# EAGLE design CompleteBoard (EAGLE 9.4.2)
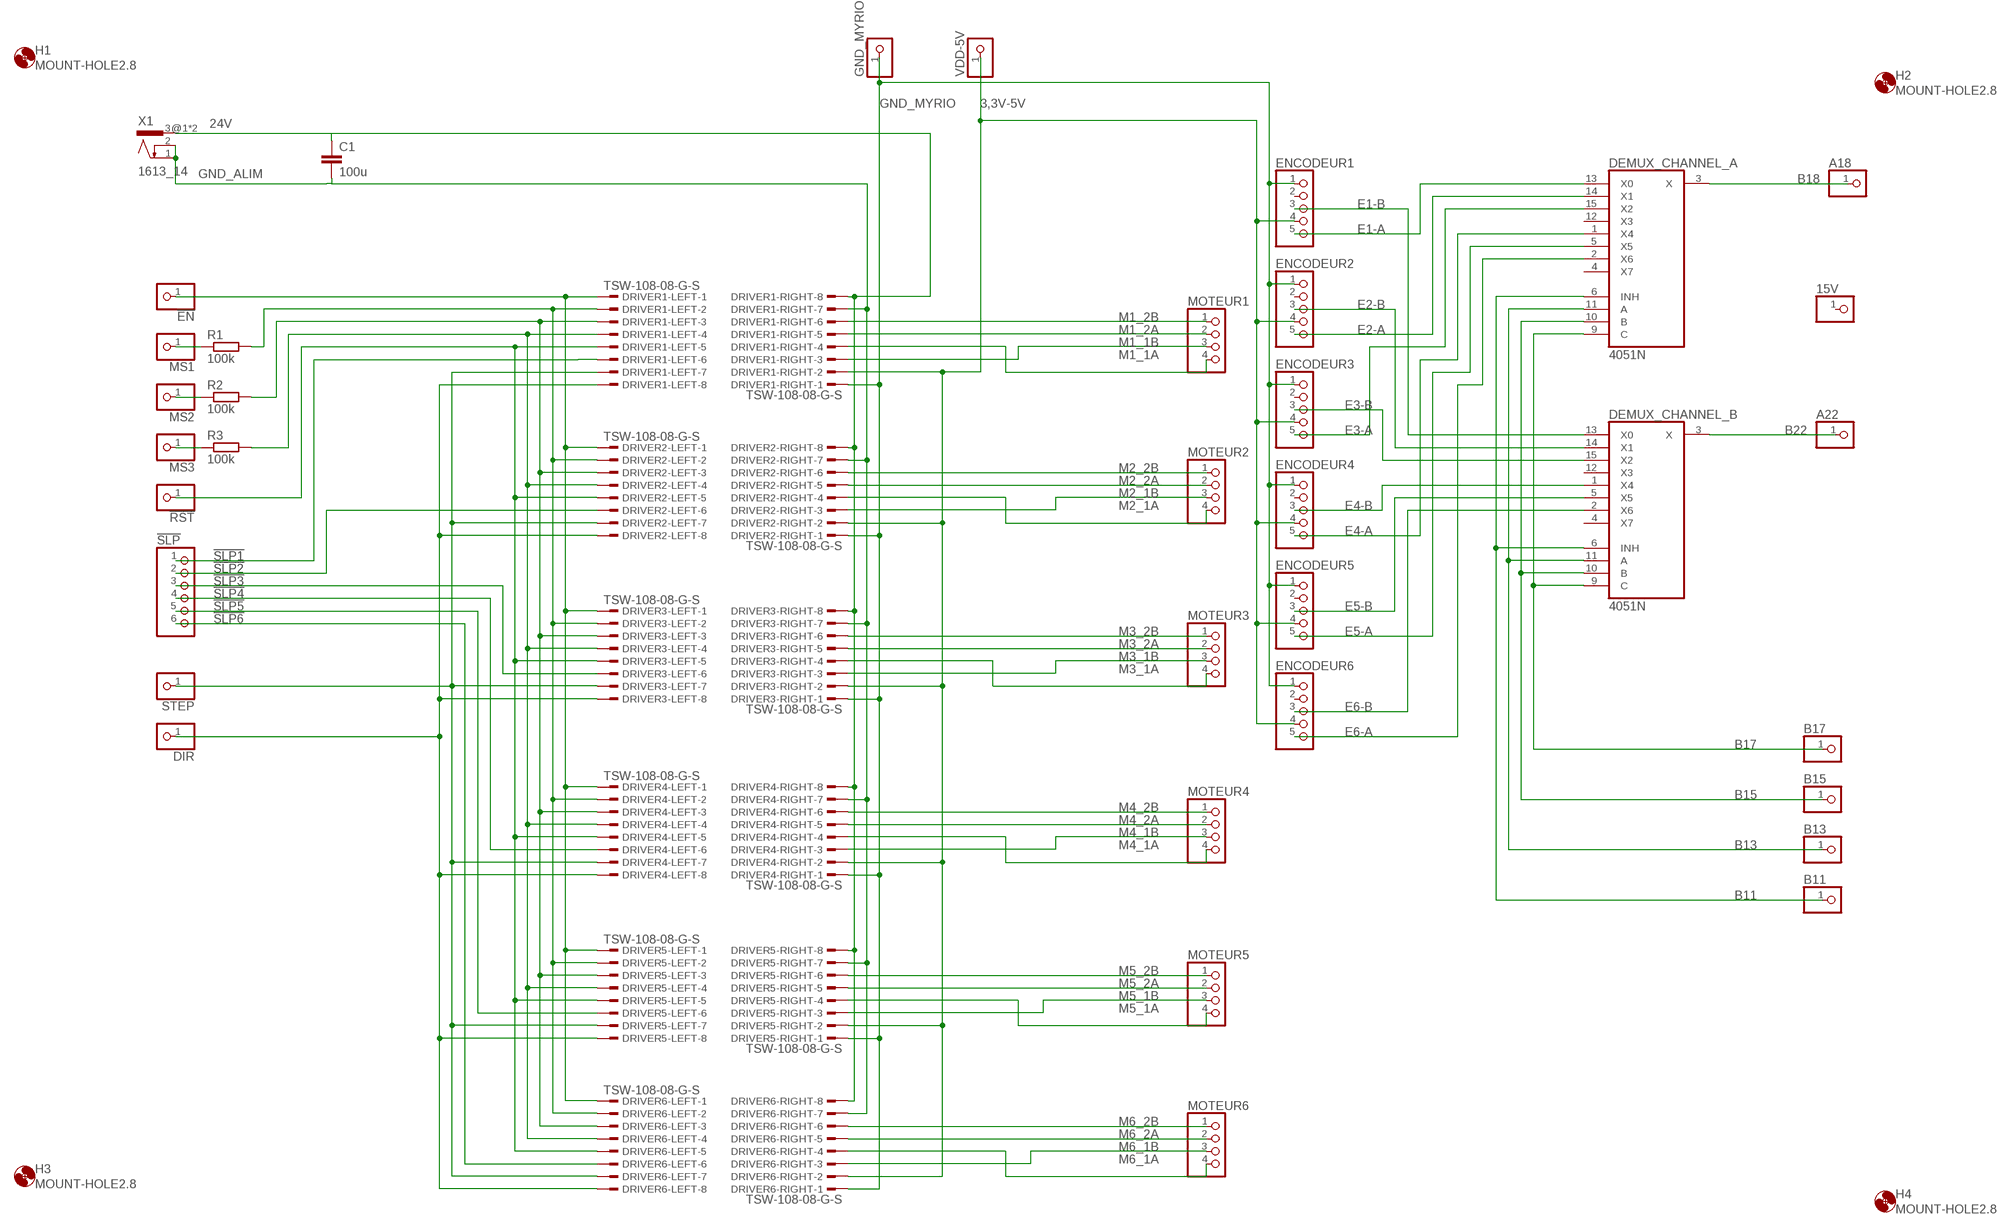
[diagram p0: schematic, sheet 1]

## Parts
15V  PINHD-1X1  [1X01]
!EN  PINHD-1X1  [1X01]
!RST  PINHD-1X1  [1X01]
!SLP  PINHD-1X6  [1X06]
A18  PINHD-1X1  [1X01]
A22  PINHD-1X1  [1X01]
B11  PINHD-1X1  [1X01]
B13  PINHD-1X1  [1X01]
B15  PINHD-1X1  [1X01]
B17  PINHD-1X1  [1X01]
C1  100u  C-EU025-025X050  [C025-025X050]
DEMUX_CHANNEL_A  4051N  [DIL16]
DEMUX_CHANNEL_B  4051N  [DIL16]
DIR  PINHD-1X1  [1X01]
DRIVER1-LEFT  TSW-108-08-G-S  [TSW-108-XX-G-S]
DRIVER1-RIGHT  TSW-108-08-G-S  [TSW-108-XX-G-S]
DRIVER2-LEFT  TSW-108-08-G-S  [TSW-108-XX-G-S]
DRIVER2-RIGHT  TSW-108-08-G-S  [TSW-108-XX-G-S]
DRIVER3-LEFT  TSW-108-08-G-S  [TSW-108-XX-G-S]
DRIVER3-RIGHT  TSW-108-08-G-S  [TSW-108-XX-G-S]
DRIVER4-LEFT  TSW-108-08-G-S  [TSW-108-XX-G-S]
DRIVER4-RIGHT  TSW-108-08-G-S  [TSW-108-XX-G-S]
DRIVER5-LEFT  TSW-108-08-G-S  [TSW-108-XX-G-S]
DRIVER5-RIGHT  TSW-108-08-G-S  [TSW-108-XX-G-S]
DRIVER6-LEFT  TSW-108-08-G-S  [TSW-108-XX-G-S]
DRIVER6-RIGHT  TSW-108-08-G-S  [TSW-108-XX-G-S]
ENCODEUR1  PINHD-1X5  [1X05]
ENCODEUR2  PINHD-1X5  [1X05]
ENCODEUR3  PINHD-1X5  [1X05]
ENCODEUR4  PINHD-1X5  [1X05]
ENCODEUR5  PINHD-1X5  [1X05]
ENCODEUR6  PINHD-1X5  [1X05]
GND_MYRIO  PINHD-1X1  [1X01]
H1  MOUNT-HOLE2.8  [2,8]
H2  MOUNT-HOLE2.8  [2,8]
H3  MOUNT-HOLE2.8  [2,8]
H4  MOUNT-HOLE2.8  [2,8]
MOTEUR1  PINHD-1X4  [1X04]
MOTEUR2  PINHD-1X4  [1X04]
MOTEUR3  PINHD-1X4  [1X04]
MOTEUR4  PINHD-1X4  [1X04]
MOTEUR5  PINHD-1X4  [1X04]
MOTEUR6  PINHD-1X4  [1X04]
MS1  PINHD-1X1  [1X01]
MS2  PINHD-1X1  [1X01]
MS3  PINHD-1X1  [1X01]
R1  100k  R-EU_0204/7  [0204/7]
R2  100k  R-EU_0204/7  [0204/7]
R3  100k  R-EU_0204/7  [0204/7]
STEP  PINHD-1X1  [1X01]
VDD-5V  PINHD-1X1  [1X01]
X1  1613_14  [1613_14]

## Nets
3,3V-5V: DRIVER1-RIGHT.2 DRIVER2-RIGHT.2 DRIVER3-RIGHT.2 DRIVER4-RIGHT.2 DRIVER5-RIGHT.2 DRIVER6-RIGHT.2 ENCODEUR1.4 ENCODEUR2.4 ENCODEUR3.4 ENCODEUR4.4 ENCODEUR5.4 ENCODEUR6.4 VDD-5V.1
24V: C1.1 DRIVER1-RIGHT.8 DRIVER2-RIGHT.8 DRIVER3-RIGHT.8 DRIVER4-RIGHT.8 DRIVER5-RIGHT.8 DRIVER6-RIGHT.8 X1.3@1 X1.3@2
!ENABLE: !EN.1 DRIVER1-LEFT.1 DRIVER2-LEFT.1 DRIVER3-LEFT.1 DRIVER4-LEFT.1 DRIVER5-LEFT.1 DRIVER6-LEFT.1
!RESET: !RST.1 DRIVER1-LEFT.5 DRIVER2-LEFT.5 DRIVER3-LEFT.5 DRIVER4-LEFT.5 DRIVER5-LEFT.5 DRIVER6-LEFT.5
!SLP1: !SLP.1 DRIVER1-LEFT.6
!SLP2: !SLP.2 DRIVER2-LEFT.6
!SLP3: !SLP.3 DRIVER3-LEFT.6
!SLP4: !SLP.4 DRIVER4-LEFT.6
!SLP5: !SLP.5 DRIVER5-LEFT.6
!SLP6: !SLP.6 DRIVER6-LEFT.6
B11: B11.1 DEMUX_CHANNEL_A.6(INH) DEMUX_CHANNEL_B.6(INH)
B13: B13.1 DEMUX_CHANNEL_A.11(A) DEMUX_CHANNEL_B.11(A)
B15: B15.1 DEMUX_CHANNEL_A.10(B) DEMUX_CHANNEL_B.10(B)
B17: B17.1 DEMUX_CHANNEL_A.9(C) DEMUX_CHANNEL_B.9(C)
B18: A18.1 DEMUX_CHANNEL_A.3(X)
B22: A22.1 DEMUX_CHANNEL_B.3(X)
DIR: DIR.1 DRIVER1-LEFT.8 DRIVER2-LEFT.8 DRIVER3-LEFT.8 DRIVER4-LEFT.8 DRIVER5-LEFT.8 DRIVER6-LEFT.8
E1-A: DEMUX_CHANNEL_A.13(X0) ENCODEUR1.5
E1-B: DEMUX_CHANNEL_B.13(X0) ENCODEUR1.3
E2-A: DEMUX_CHANNEL_A.14(X1) ENCODEUR2.5
E2-B: DEMUX_CHANNEL_B.14(X1) ENCODEUR2.3
E3-A: DEMUX_CHANNEL_A.15(X2) ENCODEUR3.5
E3-B: DEMUX_CHANNEL_B.15(X2) ENCODEUR3.3
E4-A: DEMUX_CHANNEL_A.1(X4) ENCODEUR4.5
E4-B: DEMUX_CHANNEL_B.1(X4) ENCODEUR4.3
E5-A: DEMUX_CHANNEL_A.5(X5) ENCODEUR5.5
E5-B: DEMUX_CHANNEL_B.5(X5) ENCODEUR5.3
E6-A: DEMUX_CHANNEL_A.2(X6) ENCODEUR6.5
E6-B: DEMUX_CHANNEL_B.2(X6) ENCODEUR6.3
GND_ALIM: C1.2 DRIVER1-RIGHT.7 DRIVER2-RIGHT.7 DRIVER3-RIGHT.7 DRIVER4-RIGHT.7 DRIVER5-RIGHT.7 DRIVER6-RIGHT.7 X1.1 X1.2
GND_MYRIO: DRIVER1-RIGHT.1 DRIVER2-RIGHT.1 DRIVER3-RIGHT.1 DRIVER4-RIGHT.1 DRIVER5-RIGHT.1 DRIVER6-RIGHT.1 ENCODEUR1.1 ENCODEUR2.1 ENCODEUR3.1 ENCODEUR4.1 ENCODEUR5.1 ENCODEUR6.1 GND_MYRIO.1
M1_1A: DRIVER1-RIGHT.4 MOTEUR1.4
M1_1B: DRIVER1-RIGHT.3 MOTEUR1.3
M1_2A: DRIVER1-RIGHT.5 MOTEUR1.2
M1_2B: DRIVER1-RIGHT.6 MOTEUR1.1
M2_1A: DRIVER2-RIGHT.4 MOTEUR2.4
M2_1B: DRIVER2-RIGHT.3 MOTEUR2.3
M2_2A: DRIVER2-RIGHT.5 MOTEUR2.2
M2_2B: DRIVER2-RIGHT.6 MOTEUR2.1
M3_1A: DRIVER3-RIGHT.4 MOTEUR3.4
M3_1B: DRIVER3-RIGHT.3 MOTEUR3.3
M3_2A: DRIVER3-RIGHT.5 MOTEUR3.2
M3_2B: DRIVER3-RIGHT.6 MOTEUR3.1
M4_1A: DRIVER4-RIGHT.4 MOTEUR4.4
M4_1B: DRIVER4-RIGHT.3 MOTEUR4.3
M4_2A: DRIVER4-RIGHT.5 MOTEUR4.2
M4_2B: DRIVER4-RIGHT.6 MOTEUR4.1
M5_1A: DRIVER5-RIGHT.4 MOTEUR5.4
M5_1B: DRIVER5-RIGHT.3 MOTEUR5.3
M5_2A: DRIVER5-RIGHT.5 MOTEUR5.2
M5_2B: DRIVER5-RIGHT.6 MOTEUR5.1
M6_1A: DRIVER6-RIGHT.4 MOTEUR6.4
M6_1B: DRIVER6-RIGHT.3 MOTEUR6.3
M6_2A: DRIVER6-RIGHT.5 MOTEUR6.2
M6_2B: DRIVER6-RIGHT.6 MOTEUR6.1
MS1: DRIVER1-LEFT.2 DRIVER2-LEFT.2 DRIVER3-LEFT.2 DRIVER4-LEFT.2 DRIVER5-LEFT.2 DRIVER6-LEFT.2 R1.2
MS2: DRIVER1-LEFT.3 DRIVER2-LEFT.3 DRIVER3-LEFT.3 DRIVER4-LEFT.3 DRIVER5-LEFT.3 DRIVER6-LEFT.3 R2.2
MS3: DRIVER1-LEFT.4 DRIVER2-LEFT.4 DRIVER3-LEFT.4 DRIVER4-LEFT.4 DRIVER5-LEFT.4 DRIVER6-LEFT.4 R3.2
N$1: MS1.1 R1.1
N$2: MS2.1 R2.1
N$3: MS3.1 R3.1
STEP: DRIVER1-LEFT.7 DRIVER2-LEFT.7 DRIVER3-LEFT.7 DRIVER4-LEFT.7 DRIVER5-LEFT.7 DRIVER6-LEFT.7 STEP.1
Unconnected: 15V.1 DEMUX_CHANNEL_A.4(X7) DEMUX_CHANNEL_A.12(X3) DEMUX_CHANNEL_B.4(X7) DEMUX_CHANNEL_B.12(X3) ENCODEUR1.2 ENCODEUR2.2 ENCODEUR3.2 ENCODEUR4.2 ENCODEUR5.2 ENCODEUR6.2

## Power pins joined to a net without a drawn wire
GND_ALIM: DEMUX_CHANNEL_A.7(VEE) DEMUX_CHANNEL_A.8(GND) DEMUX_CHANNEL_B.7(VEE) DEMUX_CHANNEL_B.8(GND)
VCC: DEMUX_CHANNEL_A.16(VCC) DEMUX_CHANNEL_B.16(VCC)

## Library data of the parts
15V !EN !RST A18 A22 B11 B13 B15 B17 DIR GND_MYRIO MS1-MS3 STEP VDD-5V = pinhead:PINHD-1X1: PIN HEADER
!SLP = pinhead:PINHD-1X6: PIN HEADER
C1 = rcl:C-EU: CAPACITOR, European symbol; SPICEPREFIX: C
DEMUX_CHANNEL_A DEMUX_CHANNEL_B = 40xx:4051: 8-channel ANALOG MULTIPLEXER
DRIVER1-LEFT DRIVER1-RIGHT DRIVER2-LEFT DRIVER2-RIGHT DRIVER3-LEFT DRIVER3-RIGHT DRIVER4-LEFT DRIVER4-RIGHT DRIVER5-LEFT DRIVER5-RIGHT DRIVER6-LEFT DRIVER6-RIGHT = con-samtec:TSW-108-*-G-S: THROUGH-HOLE .025" SQ POST HEADER Source: Samtec TSW.pdf; MF: Samtec Inc.; MPN: TSW-108-07-G-S
ENCODEUR1-ENCODEUR6 = pinhead:PINHD-1X5: PIN HEADER
H1-H4 = holes:MOUNT-HOLE: MOUNTING HOLE with drill center marker
MOTEUR1-MOTEUR6 = pinhead:PINHD-1X4: PIN HEADER
R1-R3 = rcl:R-EU_: RESISTOR, European symbol; SPICEPREFIX: R
X1 = con-lumberg:1613_14: Power supply connectors / Netzgeräte-Steckverbinder Source: Data sheet <http://www.farnell.com/datasheets/1733496.pdf>; MF: LUMBERG; MPN: 1613 14; OC_FARNELL: 1243245

## Board
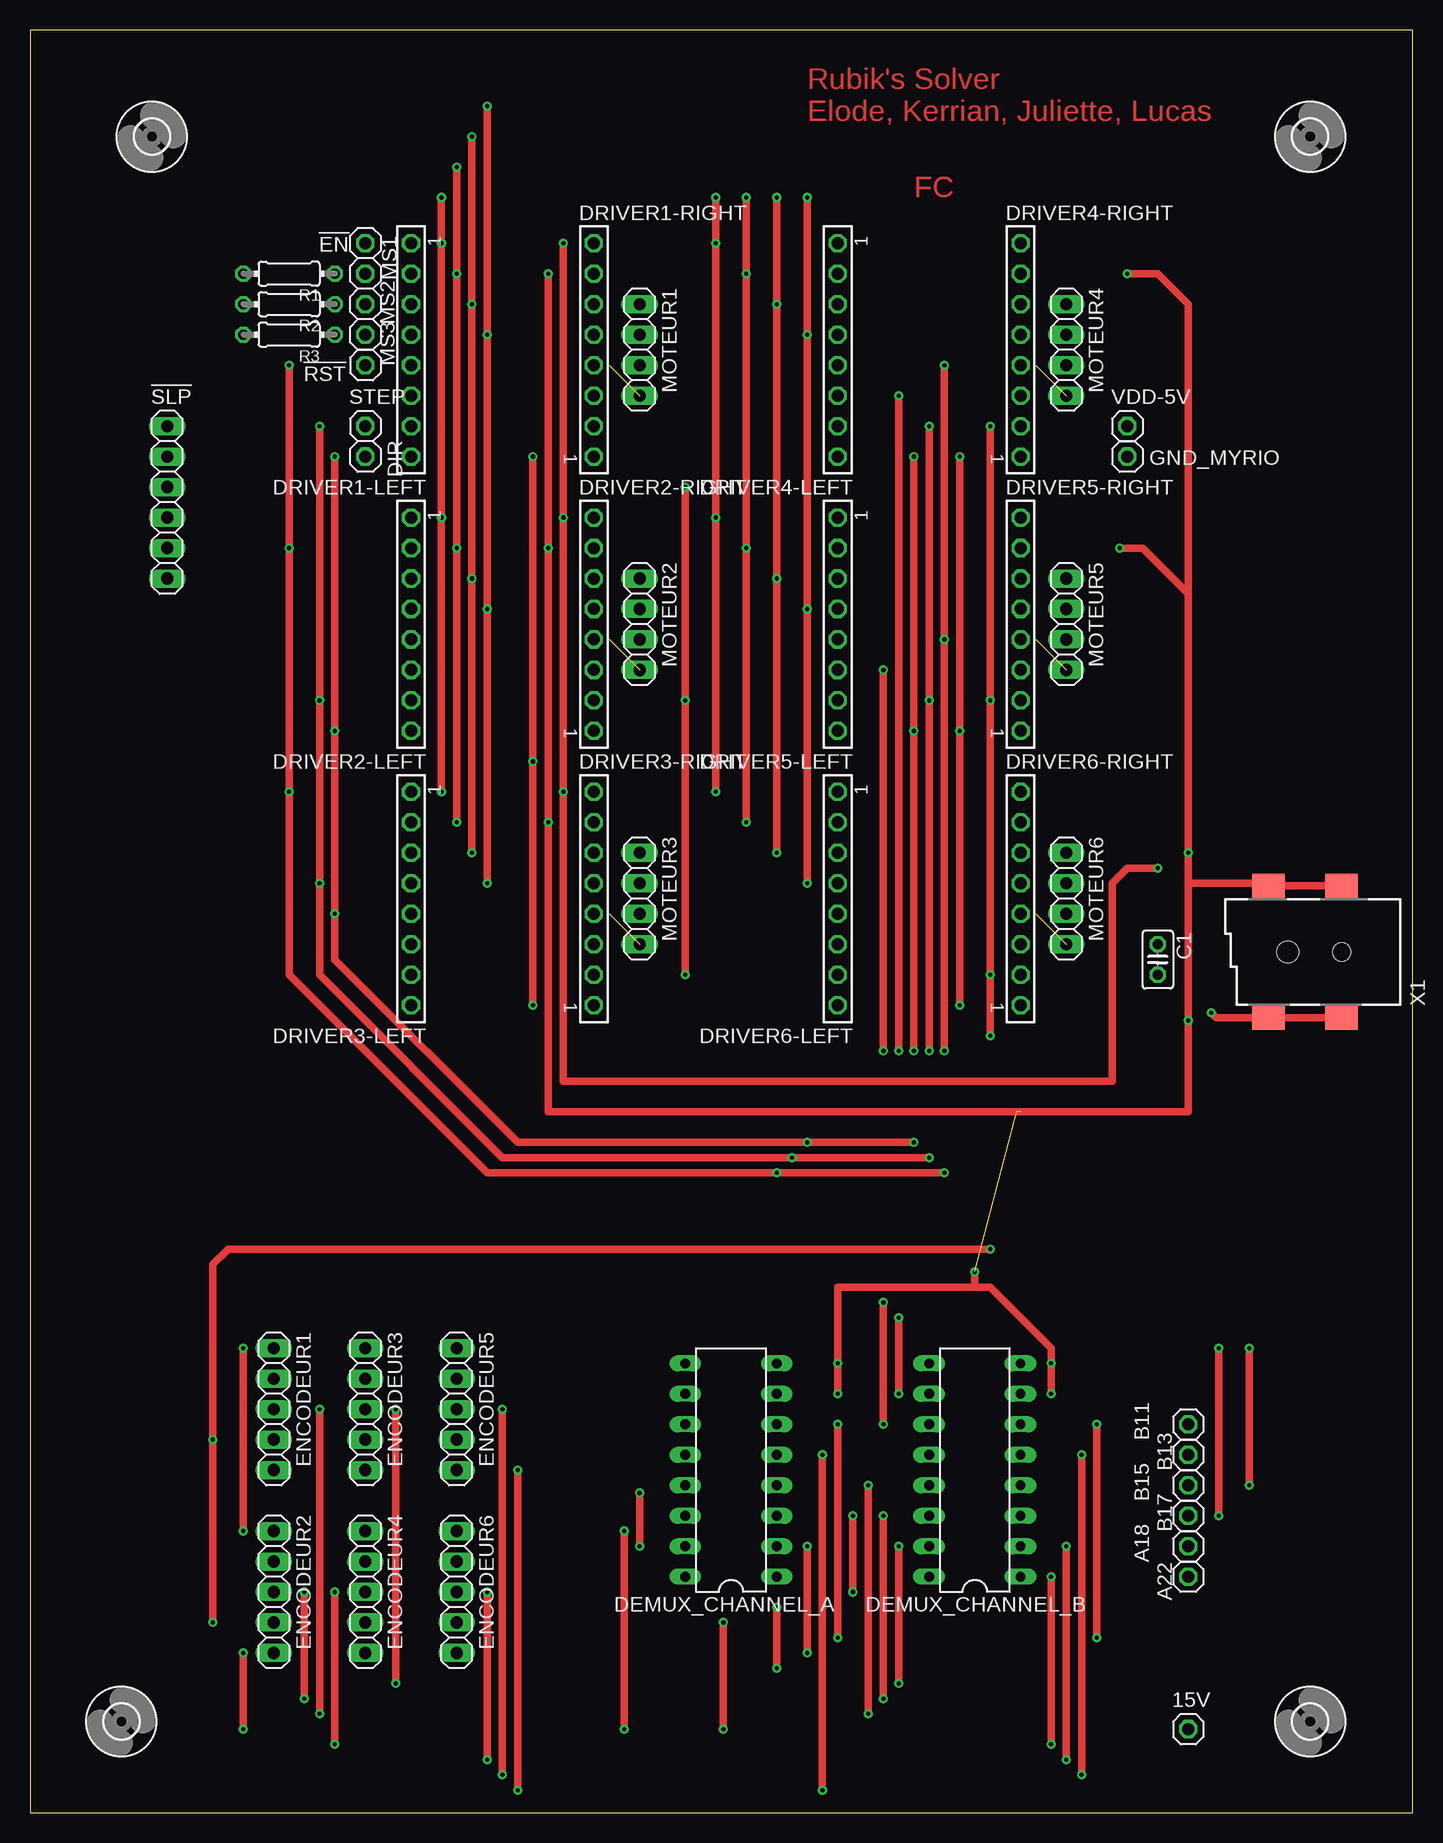
[diagram p1: board, top side]
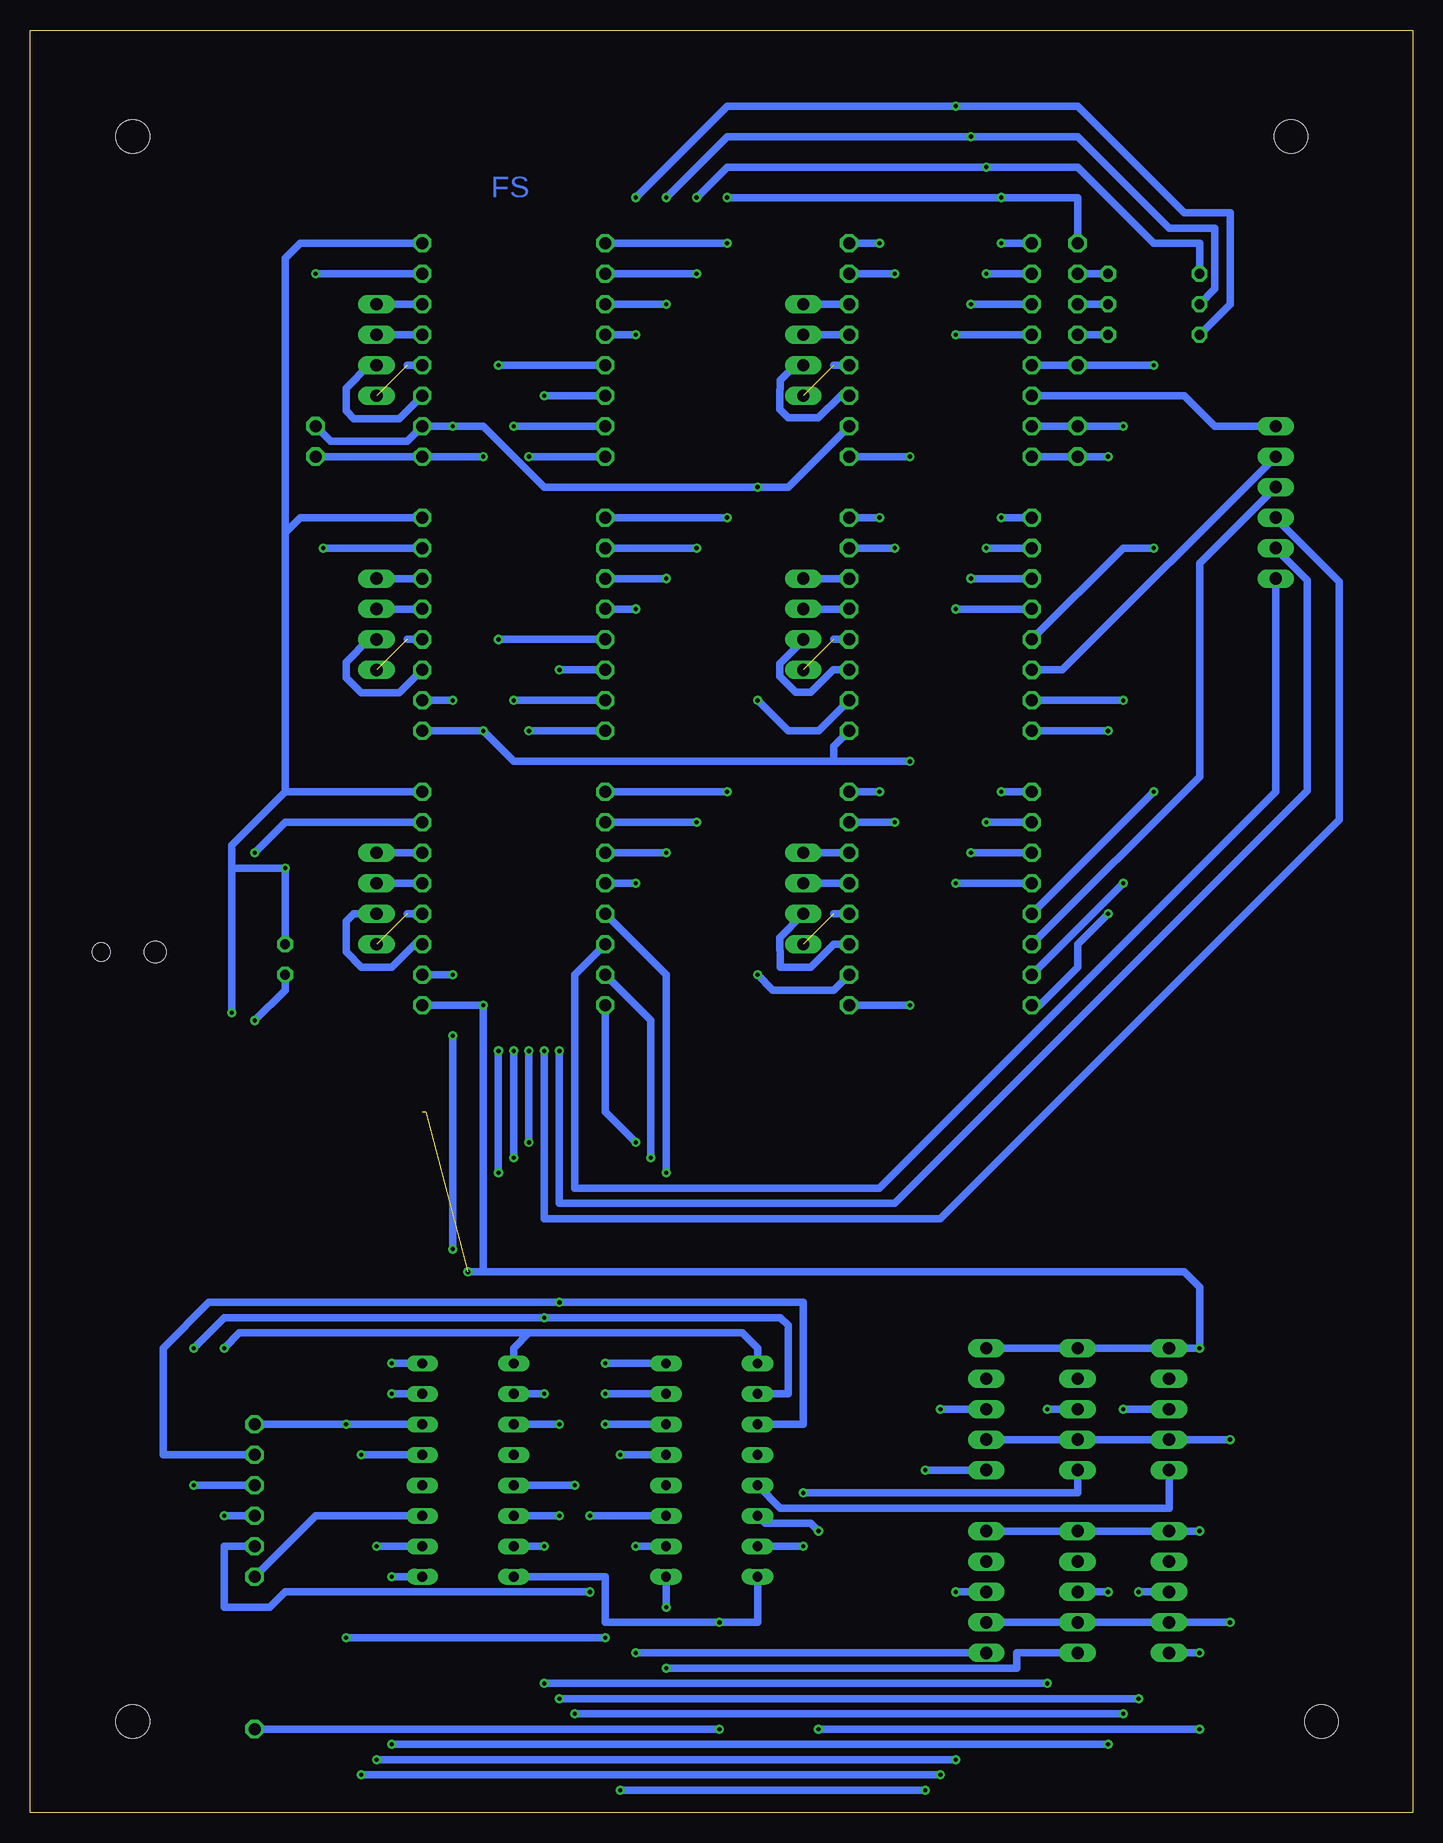
[diagram p2: board, bottom side, seen from below]

Size 115.24 x 148.58 mm. Coordinates in mm from the lower left corner, seen from the top.
Outline: 0,0 115.24,0 115.24,148.58 0,148.58 0,0
Copper layers (1*16): Top 0.035mm / dielectric 1.5mm / Bottom 0.035mm
Design rules "default": minimum track width 6mil, minimum drill 0.35mm, track to track 6mil, track to pad 6mil, pad to pad 6mil, via to via 6mil, smd to smd 6mil, copper to edge 40mil, drill to drill 6mil, minimum pad ring 10mil, minimum via ring 8mil, stop-mask expansion 4mil, vias tented up to drill 0mil, thermal gap 10mil

### Footprints (pad centres in the part's own frame; a part is rotated, then mirrored left to right if it is on the bottom)
1X01 = drill 1.016 octagon: 1 0,0
1X06 = drill 1.016 long: 1 -6.35,0; 2 -3.81,0; 3 -1.27,0; 4 1.27,0; 5 3.81,0; 6 6.35,0
C025-025X050 = drill 0.813 octagon: 1 -1.27,0; 2 1.27,0
DIL16 = drill 0.813 long: 1 -8.89,-3.81; 2 -6.35,-3.81; 3 -3.81,-3.81; 4 -1.27,-3.81; 5 1.27,-3.81; 6 3.81,-3.81; 7 6.35,-3.81; 8 8.89,-3.81; 9 8.89,3.81; 10 6.35,3.81; 11 3.81,3.81; 12 1.27,3.81; 13 -1.27,3.81; 14 -3.81,3.81; 15 -6.35,3.81; 16 -8.89,3.81
TSW-108-XX-G-S = drill 1 pad 1.5 octagon: 1 8.89,0; 2 6.35,0; 3 3.81,0; 4 1.27,0; 5 -1.27,0; 6 -3.81,0; 7 -6.35,0; 8 -8.89,0
1X05 = drill 1.016 long: 1 -5.08,0; 2 -2.54,0; 3 0,0; 4 2.54,0; 5 5.08,0
2,8 = hole 2.8: 0,0
1X04 = drill 1.016 long: 1 -3.81,0; 2 -1.27,0; 3 1.27,0; 4 3.81,0
0204/7 = drill 0.813 octagon: 1 -3.81,0; 2 3.81,0
1613_14 = smd 2 x 2.7: 1 5.5,5; 2 5.5,11.1; 3@1 -5.5,11.1; 3@2 -5.5,5 | hole 1.5: 0,5 | hole 1.8: 0,9.5

### Placement (x,y rotation side)
15V  96.52,6.98 0 top
!EN  27.94,130.81 270 top
!RST  27.94,120.65 0 top
!SLP  11.43,109.22 270 top
A18  96.52,22.23 0 top
A22  96.52,19.69 0 top
B11  96.52,32.39 0 top
B13  96.52,29.84 0 top
B15  96.52,27.3 0 top
B17  96.52,24.77 0 top
C1  93.98,71.12 270 top
DEMUX_CHANNEL_A  58.42,28.58 90 top
DEMUX_CHANNEL_B  78.74,28.58 90 top
DIR  27.94,113.03 270 top
DRIVER1-LEFT  31.75,121.92 90 top
DRIVER1-RIGHT  46.99,121.92 270 top
DRIVER2-LEFT  31.75,99.06 90 top
DRIVER2-RIGHT  46.99,99.06 270 top
DRIVER3-LEFT  31.75,76.2 90 top
DRIVER3-RIGHT  46.99,76.2 270 top
DRIVER4-LEFT  67.31,121.92 90 top
DRIVER4-RIGHT  82.55,121.92 270 top
DRIVER5-LEFT  67.31,99.06 90 top
DRIVER5-RIGHT  82.55,99.06 270 top
DRIVER6-LEFT  67.31,76.2 90 top
DRIVER6-RIGHT  82.55,76.2 270 top
ENCODEUR1  20.32,33.66 270 top
ENCODEUR2  20.32,18.41 270 top
ENCODEUR3  27.94,33.66 270 top
ENCODEUR4  27.94,18.41 270 top
ENCODEUR5  35.56,33.66 270 top
ENCODEUR6  35.56,18.41 270 top
GND_MYRIO  91.44,113.03 0 top
H1  10.16,139.7 0 top
H2  7.62,7.62 0 top
H3  106.68,139.7 0 top
H4  106.68,7.62 0 top
MOTEUR1  50.8,121.92 270 top
MOTEUR2  50.8,99.06 270 top
MOTEUR3  50.8,76.2 270 top
MOTEUR4  86.36,121.92 270 top
MOTEUR5  86.36,99.06 270 top
MOTEUR6  86.36,76.2 270 top
MS1  27.94,128.27 270 top
MS2  27.94,125.73 270 top
MS3  27.94,123.19 270 top
R1  21.59,128.27 180 top
R2  21.59,125.73 180 top
R3  21.59,123.19 180 top
STEP  27.94,115.57 0 top
VDD-5V  91.44,115.57 0 top
X1  114.3,71.75 90 top

### Tracks (layer width: path | path; a pad name or v marks a point on that pad's centre or on a via)
3,3V-5V  (via drill 0.35)
  Top 0.61: v54.61,110.49 v54.61,92.71 v54.61,69.85 | v80.01,115.57 v80.01,92.71 v80.01,69.85 v80.01,64.77 | v15.24,15.88 v15.24,31.12 15.24,45.72 16.51,46.99 v80.01,46.99
  Bottom 0.61: VDD-5V.1 90.17,114.3 83.82,114.3 DRIVER4-RIGHT.2 v80.01,115.57 77.47,115.57 72.39,110.49 v54.61,110.49 52.07,110.49 DRIVER1-RIGHT.2 | DRIVER2-RIGHT.2 49.53,90.17 52.07,90.17 v54.61,92.71 | DRIVER3-RIGHT.2 48.26,68.58 53.34,68.58 v54.61,69.85 | v80.01,92.71 DRIVER5-RIGHT.2 | v80.01,69.85 DRIVER6-RIGHT.2 | v15.24,15.88 ENCODEUR2.4 ENCODEUR4.4 ENCODEUR6.4 | v80.01,64.77 v80.01,46.99 | ENCODEUR5.4 ENCODEUR3.4 ENCODEUR1.4 v15.24,31.12
24V  (via drill 0.35)
  Top 0.61: v44.45,130.81 v44.45,107.95 v44.45,85.09 44.45,60.96 90.17,60.96 90.17,77.47 91.44,78.74 v93.98,78.74 | X1.3@2 X1.3@1 98.84,66.25 v98.42,66.67
  Bottom 0.61: 93.98,85.09 98.42,80.64 98.42,78.74 | 93.98,85.09 DRIVER6-RIGHT.8 | 93.98,85.09 93.98,106.68 | 93.98,106.68 92.71,107.95 DRIVER5-RIGHT.8 | 93.98,106.68 93.98,129.54 92.71,130.81 DRIVER4-RIGHT.8 | v44.45,107.95 DRIVER2-RIGHT.8 | v44.45,130.81 DRIVER1-RIGHT.8 | v44.45,85.09 DRIVER3-RIGHT.8 | 98.42,78.74 v93.98,78.74 C1.1 | v98.42,66.67 98.42,78.74
!ENABLE  (via drill 0.35)
  Top 0.61: v57.15,85.09 v57.15,107.95 v57.15,130.81 v57.15,134.62 | v34.29,134.62 v34.29,130.81 v34.29,107.95 v34.29,85.09
  Bottom 0.61: !EN.1 27.94,134.62 v34.29,134.62 v57.15,134.62 | v57.15,107.95 DRIVER5-LEFT.1 | v57.15,85.09 DRIVER6-LEFT.1 | DRIVER4-LEFT.1 v57.15,130.81 | v34.29,107.95 DRIVER2-LEFT.1 | v34.29,85.09 DRIVER3-LEFT.1 | v34.29,130.81 DRIVER1-LEFT.1
!RESET  (via drill 0.35)
  Top 0.61: v21.59,120.65 v21.59,105.41 v21.59,85.09 21.59,69.85 38.1,53.34 v62.23,53.34 v76.2,53.34 | v76.2,63.5 v76.2,97.79 v76.2,120.65
  Bottom 0.61: DRIVER1-LEFT.5 !RST.1 v21.59,120.65 | v21.59,105.41 24.13,105.41 DRIVER2-LEFT.5 | v62.23,53.34 62.23,69.85 DRIVER6-LEFT.5 | v76.2,53.34 v76.2,63.5 | v76.2,97.79 DRIVER5-LEFT.5 | v76.2,120.65 DRIVER4-LEFT.5 | DRIVER3-LEFT.5 v21.59,85.09
!SLP1
  Bottom 0.61: !SLP.1 16.51,115.57 19.05,118.11 DRIVER1-LEFT.6
!SLP2
  Bottom 0.61: !SLP.2 29.21,95.25 DRIVER2-LEFT.6
!SLP3
  Bottom 0.61: !SLP.3 17.78,104.14 17.78,86.36 DRIVER3-LEFT.6
!SLP4  (via drill 0.35)
  Top 0.61: v72.39,63.5 v72.39,118.11
  Bottom 0.61: !SLP.4 11.43,107.9 6.15,102.61 6.15,82.75 39.37,49.53 72.39,49.53 v72.39,63.5 | v72.39,118.11 DRIVER4-LEFT.6
!SLP5  (via drill 0.35)
  Top 0.61: v71.12,63.5 v71.12,95.25
  Bottom 0.61: !SLP.5 11.43,105.36 8.81,102.74 8.81,85.17 43.18,50.8 71.12,50.8 v71.12,63.5 | v71.12,95.25 DRIVER5-LEFT.6
!SLP6
  Bottom 0.61: !SLP.6 11.43,85.09 44.45,52.07 69.85,52.07 69.85,69.85 DRIVER6-LEFT.6
B11  (via drill 0.35)
  Top 0.61: v88.9,32.39 v88.9,14.6 | v67.31,14.6 v67.31,32.39
  Bottom 0.61: B11.1 v88.9,32.39 DEMUX_CHANNEL_B.6 | v88.9,14.6 v67.31,14.6 | v67.31,32.39 DEMUX_CHANNEL_A.6
B13  (via drill 0.35)
  Top 0.61: v71.12,42.55 v71.12,32.39
  Bottom 0.61: DEMUX_CHANNEL_A.11 50.8,32.39 50.8,42.55 v71.12,42.55 100.33,42.55 104.14,38.73 104.14,29.84 B13.1 | v71.12,32.39 DEMUX_CHANNEL_B.11
B15  (via drill 0.35)
  Top 0.61: v72.39,41.27 v72.39,34.92 | v101.6,38.73 v101.6,27.3
  Bottom 0.61: DEMUX_CHANNEL_A.10 52.07,34.92 52.07,40.64 52.7,41.27 v72.39,41.27 99.06,41.27 v101.6,38.73 | v72.39,34.92 DEMUX_CHANNEL_B.10 | v101.6,27.3 B15.1
B17  (via drill 0.35)
  Top 0.61: v99.06,38.73 v99.06,24.77
  Bottom 0.61: DEMUX_CHANNEL_A.9 54.61,38.73 55.88,40 73.66,40 | DEMUX_CHANNEL_B.9 74.93,38.73 73.66,40 | 73.66,40 97.79,40 v99.06,38.73 | v99.06,24.77 B17.1
B18  (via drill 0.35)
  Top 0.61: v68.58,18.41 v68.58,24.77
  Bottom 0.61: v68.58,24.77 DEMUX_CHANNEL_A.3 | v68.58,18.41 93.98,18.41 95.25,17.15 99.06,17.15 99.06,22.23 A18.1
B22
  Bottom 0.61: DEMUX_CHANNEL_B.3 91.44,24.77 A22.1
DIR  (via drill 0.35)
  Top 0.61: v25.4,113.03 v25.4,90.17 v25.4,74.93 25.4,71.12 40.64,55.88 v64.77,55.88 v73.66,55.88 | v73.66,63.5 v73.66,90.17 v73.66,113.03
  Bottom 0.61: DRIVER1-LEFT.8 DIR.1 v25.4,113.03 | v25.4,74.93 27.94,72.39 27.94,70.48 31.11,67.31 DRIVER3-LEFT.8 | v25.4,90.17 DRIVER2-LEFT.8 | v64.77,55.88 67.31,58.42 DRIVER6-LEFT.8 | v73.66,55.88 v73.66,63.5 | v73.66,90.17 DRIVER5-LEFT.8 | v73.66,113.03 DRIVER4-LEFT.8
E1-A
  Bottom 0.61: ENCODEUR1.5 20.32,25.4 52.7,25.4 DEMUX_CHANNEL_A.13
E1-B  (via drill 0.35)
  Top 0.61: v24.13,33.66 v24.13,8.26 | v69.85,8.26 v69.85,27.3
  Bottom 0.61: ENCODEUR1.3 v24.13,33.66 | v24.13,8.26 v69.85,8.26 | v69.85,27.3 DEMUX_CHANNEL_B.13
E2-A  (via drill 0.35)
  Top 0.61: v17.78,13.34 v17.78,6.98 | v49.53,6.98 v49.53,23.49
  Bottom 0.61: ENCODEUR2.5 v17.78,13.34 | v17.78,6.98 v49.53,6.98 | v49.53,23.49 50.16,24.13 53.98,24.13 DEMUX_CHANNEL_A.14
E2-B  (via drill 0.35)
  Top 0.61: v22.86,18.41 v22.86,9.52 | v71.12,9.52 v71.12,24.77
  Bottom 0.61: ENCODEUR2.3 v22.86,18.41 | v22.86,9.52 v71.12,9.52 | v71.12,24.77 DEMUX_CHANNEL_B.14
E3-A  (via drill 0.35)
  Top 0.61: v50.8,26.67 v50.8,22.23
  Bottom 0.61: ENCODEUR3.5 27.94,26.67 v50.8,26.67 | v50.8,22.23 DEMUX_CHANNEL_A.15
E3-B  (via drill 0.35)
  Top 0.61: v30.48,33.66 v30.48,10.8 | v72.39,10.8 v72.39,22.23
  Bottom 0.61: ENCODEUR3.3 v30.48,33.66 | v30.48,10.8 v72.39,10.8 | v72.39,22.23 DEMUX_CHANNEL_B.15
E4-A  (via drill 0.35)
  Top 0.61: v62.23,12.06 v62.23,17.15
  Bottom 0.61: ENCODEUR4.5 33.02,13.34 33.02,12.06 v62.23,12.06 | v62.23,17.15 DEMUX_CHANNEL_A.1
E4-B  (via drill 0.35)
  Top 0.61: v25.4,18.41 v25.4,5.72 | v85.09,5.72 v85.09,19.69
  Bottom 0.61: ENCODEUR4.3 v25.4,18.41 | v25.4,5.72 v85.09,5.72 | v85.09,19.69 DEMUX_CHANNEL_B.1
E5-A  (via drill 0.35)
  Top 0.61: v40.64,28.58 v40.64,1.91 | v66.04,1.91 v66.04,29.84
  Bottom 0.61: ENCODEUR5.5 v40.64,28.58 | v40.64,1.91 v66.04,1.91 | v66.04,29.84 DEMUX_CHANNEL_A.5
E5-B  (via drill 0.35)
  Top 0.61: v39.37,33.66 v39.37,3.17 | v87.63,3.17 v87.63,29.84
  Bottom 0.61: ENCODEUR5.3 v39.37,33.66 | v39.37,3.17 v87.63,3.17 | v87.63,29.84 DEMUX_CHANNEL_B.5
E6-A  (via drill 0.35)
  Top 0.61: v64.77,13.34 v64.77,22.23
  Bottom 0.61: ENCODEUR6.5 v64.77,13.34 | v64.77,22.23 DEMUX_CHANNEL_A.2
E6-B  (via drill 0.35)
  Top 0.61: v38.1,18.41 v38.1,4.45 | v86.36,4.45 v86.36,22.23
  Bottom 0.61: ENCODEUR6.3 v38.1,18.41 | v38.1,4.45 v86.36,4.45 | v86.36,22.23 DEMUX_CHANNEL_B.2
GND_ALIM  (via drill 0.35)  (2 unrouted)
  Top 0.61: 96.52,101.6 v96.52,80.01 96.52,77.47 | 96.52,101.6 96.52,125.73 93.98,128.27 v91.44,128.27 | 96.52,101.6 92.71,105.41 v90.81,105.41 | 82.23,58.42 96.52,58.42 v96.52,66.04 96.52,77.47 | 82.55,58.42 43.18,58.42 v43.18,82.55 v43.18,105.41 v43.18,128.27 | v67.31,34.92 v67.31,37.47 67.31,43.81 78.74,43.81 | v85.09,34.92 v85.09,37.47 85.09,38.73 80.01,43.81 78.74,43.81 | 78.74,43.81 v78.74,45.09 | X1.1 X1.2 102.98,77.47 96.52,77.47
  Bottom 0.61: v96.52,80.01 93.98,82.55 DRIVER6-RIGHT.7 | v91.44,128.27 DRIVER4-RIGHT.7 | v90.81,105.41 DRIVER5-RIGHT.7 | v43.18,128.27 DRIVER1-RIGHT.7 | v43.18,105.41 DRIVER2-RIGHT.7 | DRIVER3-RIGHT.7 v43.18,82.55 | v96.52,66.04 93.98,68.58 C1.2 | DEMUX_CHANNEL_B.8 v85.09,37.47 | DEMUX_CHANNEL_A.7 v67.31,34.92 | v85.09,34.92 DEMUX_CHANNEL_B.7 | DEMUX_CHANNEL_A.8 v67.31,37.47 | v78.74,45.09 77.37,45.09
GND_MYRIO  (via drill 0.35)
  Top 0.61: v77.47,113.03 v77.47,90.17 v77.47,67.31 | v41.91,67.31 v41.91,87.63 v41.91,113.03 | v17.78,23.49 v17.78,38.73
  Bottom 0.61: GND_MYRIO.1 DRIVER4-RIGHT.1 v77.47,113.03 | DRIVER5-RIGHT.1 v77.47,90.17 74.93,87.63 48.26,87.63 | DRIVER6-RIGHT.1 v77.47,67.31 77.47,45.09 19.05,45.09 17.78,43.81 v17.78,38.73 ENCODEUR1.1 ENCODEUR3.1 ENCODEUR5.1 | v41.91,87.63 48.26,87.63 | v41.91,67.31 DRIVER3-RIGHT.1 | v41.91,113.03 DRIVER1-RIGHT.1 | 48.26,87.63 48.26,88.9 DRIVER2-RIGHT.1 | ENCODEUR6.1 ENCODEUR4.1 ENCODEUR2.1 v17.78,23.49
M1_1A  (1 unrouted)
  Bottom 0.61: DRIVER1-RIGHT.4 48.26,120.65
M1_1B
  Bottom 0.61: DRIVER1-RIGHT.3 47.68,118.11 49.53,116.26 52.07,116.26 52.78,116.97 52.78,118.62 52.7,118.69 52.7,119.38 51.44,120.65 MOTEUR1.3
M1_2A
  Bottom 0.61: DRIVER1-RIGHT.5 MOTEUR1.2
M1_2B
  Bottom 0.61: DRIVER1-RIGHT.6 MOTEUR1.1
M2_1A  (1 unrouted)
  Bottom 0.61: DRIVER2-RIGHT.4 48.26,97.79
M2_1B
  Bottom 0.61: DRIVER2-RIGHT.3 48.31,95.25 50.17,93.4 51.43,93.4 52.78,94.75 52.78,95.75 50.8,97.74 MOTEUR2.3
M2_2A
  Bottom 0.61: MOTEUR2.2 DRIVER2-RIGHT.5
M2_2B
  Bottom 0.61: MOTEUR2.1 DRIVER2-RIGHT.6
M3_1A  (1 unrouted)
  Bottom 0.61: DRIVER3-RIGHT.4 48.26,74.93
M3_1B
  Bottom 0.61: DRIVER3-RIGHT.3 48.26,72.39 50.16,70.48 52.7,70.48 52.7,71.81 52.78,71.89 52.78,72.95 MOTEUR3.3
M3_2A
  Bottom 0.61: MOTEUR3.2 DRIVER3-RIGHT.5
M3_2B
  Bottom 0.61: MOTEUR3.1 DRIVER3-RIGHT.6
M4_1A  (1 unrouted)
  Bottom 0.61: DRIVER4-RIGHT.4 83.82,120.65
M4_1B
  Bottom 0.61: MOTEUR4.3 87,120.65 88.9,118.75 88.9,116.84 88.27,116.2 84.45,116.2 DRIVER4-RIGHT.3
M4_2A
  Bottom 0.61: MOTEUR4.2 DRIVER4-RIGHT.5
M4_2B
  Bottom 0.61: MOTEUR4.1 DRIVER4-RIGHT.6
M5_1A  (1 unrouted)
  Bottom 0.61: DRIVER5-RIGHT.4 83.82,97.79
M5_1B
  Bottom 0.61: MOTEUR5.3 87,97.79 88.9,95.88 88.9,94.61 87.63,93.34 84.45,93.34 DRIVER5-RIGHT.3
M5_2A
  Bottom 0.61: MOTEUR5.2 DRIVER5-RIGHT.5
M5_2B
  Bottom 0.61: MOTEUR5.1 DRIVER5-RIGHT.6
M6_1A  (1 unrouted)
  Bottom 0.61: DRIVER6-RIGHT.4 83.82,74.93
M6_1B
  Bottom 0.61: DRIVER6-RIGHT.3 83.19,72.39 85.09,70.48 87.63,70.48 88.9,71.75 88.9,74.3 88.27,74.93 MOTEUR6.3
M6_2A
  Bottom 0.61: MOTEUR6.2 DRIVER6-RIGHT.5
M6_2B
  Bottom 0.61: MOTEUR6.1 DRIVER6-RIGHT.6
MS1  (via drill 0.35)
  Top 0.61: v59.69,134.62 v59.69,128.27 v59.69,105.41 v59.69,82.55 | v35.56,137.16 v35.56,128.27 v35.56,105.41 v35.56,82.55
  Bottom 0.61: v59.69,128.27 DRIVER4-LEFT.2 | v59.69,105.41 DRIVER5-LEFT.2 | v59.69,82.55 DRIVER6-LEFT.2 | v59.69,134.62 57.15,137.16 v35.56,137.16 27.94,137.16 21.59,130.81 17.78,130.81 R1.2 | v35.56,105.41 DRIVER2-LEFT.2 | v35.56,82.55 DRIVER3-LEFT.2 | v35.56,128.27 DRIVER1-LEFT.2
MS2  (via drill 0.35)
  Top 0.61: v62.23,134.62 v62.23,125.73 v62.23,102.87 v62.23,80.01 | v36.83,139.7 v36.83,125.73 v36.83,102.87 v36.83,80.01
  Bottom 0.61: v62.23,125.73 DRIVER4-LEFT.3 | v62.23,102.87 DRIVER5-LEFT.3 | v62.23,80.01 DRIVER6-LEFT.3 | v62.23,134.62 57.15,139.7 v36.83,139.7 27.94,139.7 20.32,132.08 16.51,132.08 16.51,127 R2.2 | v36.83,102.87 DRIVER2-LEFT.3 | v36.83,80.01 DRIVER3-LEFT.3 | v36.83,125.73 DRIVER1-LEFT.3
MS3  (via drill 0.35)
  Top 0.61: v64.77,134.62 v64.77,123.19 v64.77,100.33 v64.77,77.47 | v38.1,142.24 v38.1,123.19 v38.1,100.33 v38.1,77.47
  Bottom 0.61: v64.77,123.19 DRIVER4-LEFT.4 | v64.77,100.33 DRIVER5-LEFT.4 | v64.77,77.47 DRIVER6-LEFT.4 | v64.77,134.62 57.15,142.24 v38.1,142.24 27.94,142.24 19.05,133.35 15.24,133.35 15.24,125.73 R3.2 | v38.1,100.33 DRIVER2-LEFT.4 | v38.1,77.47 DRIVER3-LEFT.4 | v38.1,123.19 DRIVER1-LEFT.4
N$1
  Bottom 0.61: MS1.1 R1.1
N$2
  Bottom 0.61: MS2.1 R2.1
N$3
  Bottom 0.61: MS3.1 R3.1
STEP  (via drill 0.35)
  Top 0.61: v24.13,115.57 v24.13,92.71 v24.13,77.47 24.13,69.85 39.37,54.61 v63.5,54.61 v74.93,54.61 | v74.93,63.5 v74.93,92.71 v74.93,115.57
  Bottom 0.61: DRIVER1-LEFT.7 STEP.1 v24.13,115.57 | v24.13,92.71 DRIVER2-LEFT.7 | v63.5,54.61 63.5,66.04 DRIVER6-LEFT.7 | v74.93,54.61 v74.93,63.5 | v74.93,92.71 DRIVER5-LEFT.7 | v74.93,115.57 DRIVER4-LEFT.7 | DRIVER3-LEFT.7 v24.13,77.47
VCC  (via drill 0.35)
  Top 0.61: v57.78,15.88 v57.78,6.98
  Bottom 0.61: DEMUX_CHANNEL_B.16 67.31,19.69 67.31,15.88 v57.78,15.88 54.61,15.88 DEMUX_CHANNEL_A.16 | v57.78,6.98 96.57,6.98

### Text on the board
Top: Rubik's Solver / Elode, Kerrian, Juliette, Lucas | FC
Bottom: FS